# EAGLE design CapSens (EAGLE 7.2.0)
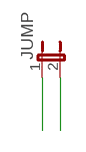
[diagram p0: schematic, sheet 1]

## Parts
JUMP  JP1E  [JP1]

## Nets
N$1: JUMP.1
N$2: JUMP.2

## Library data of the parts
JUMP = jumper:JP1E: JUMPER

## Board
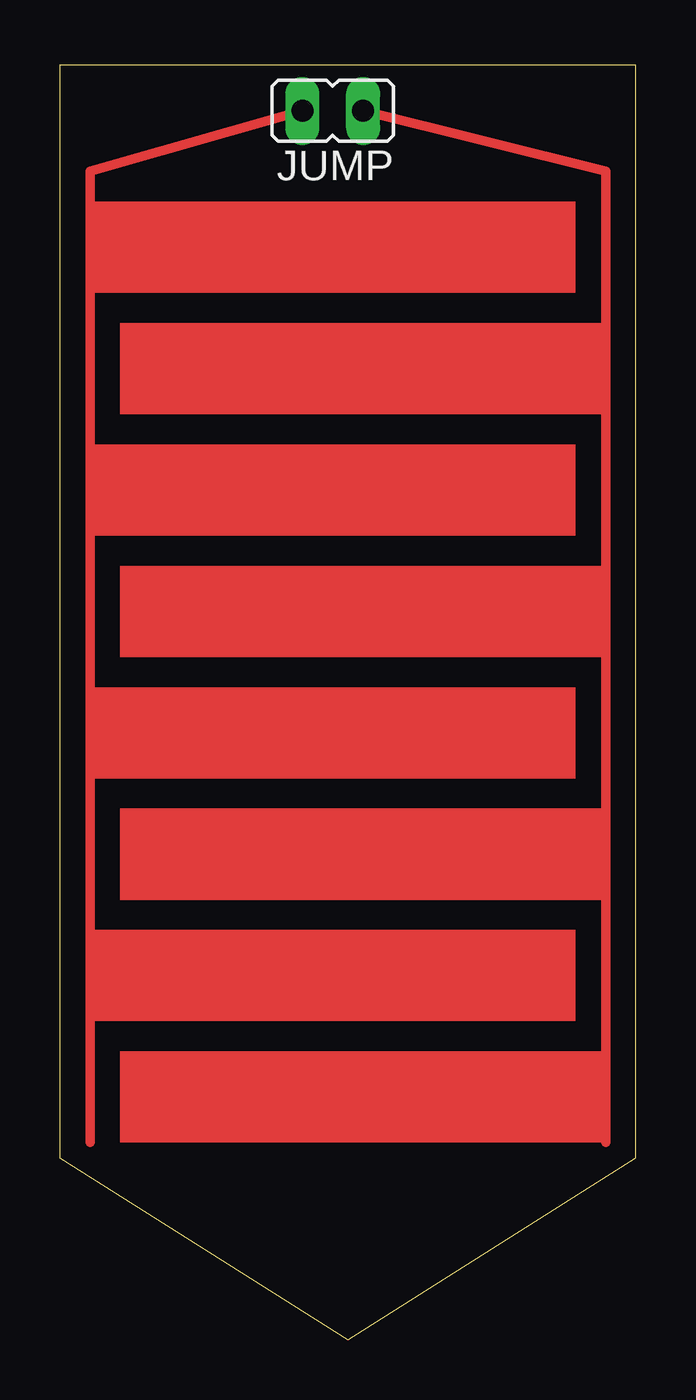
[diagram p1: board, top side]
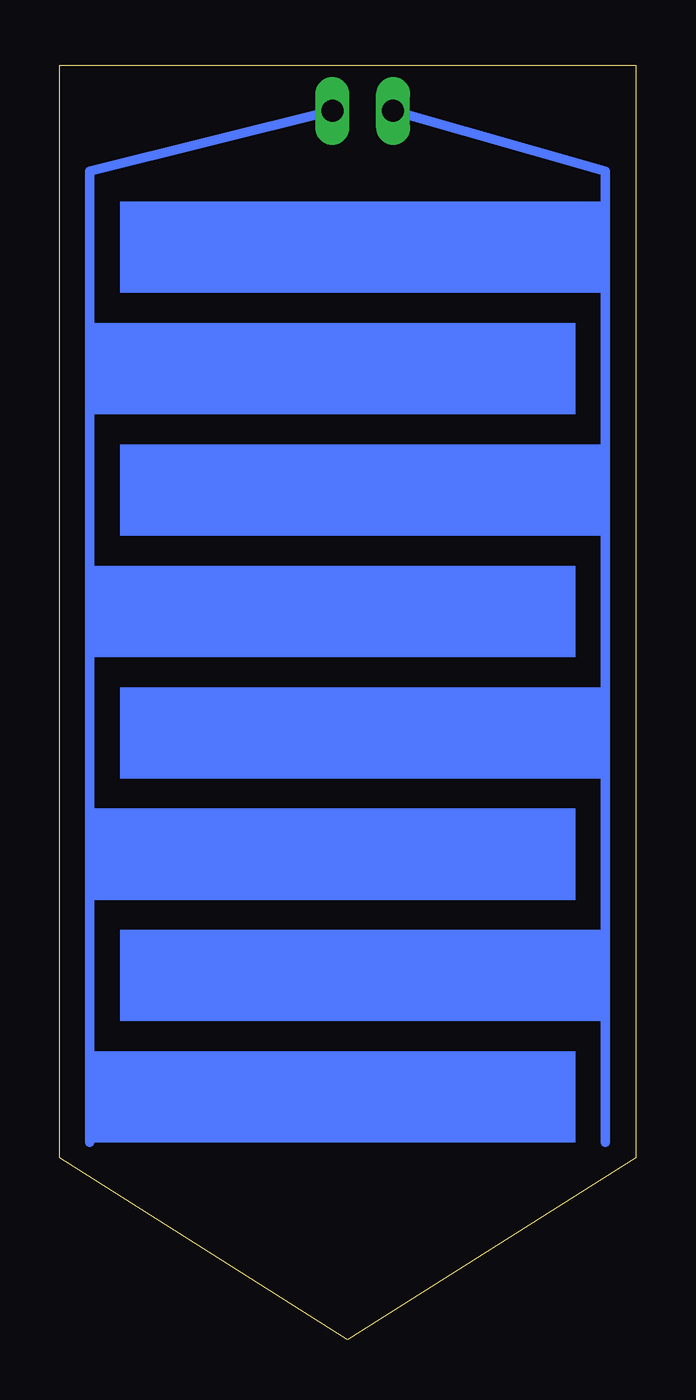
[diagram p2: board, bottom side, seen from below]

Size 24.12 x 53.33 mm. Coordinates in mm from the lower left corner, seen from the top.
Outline: 0,7.62 12.06,0 24.12,7.62 24.12,53.33 0,53.33 0,7.62
Copper layers (1*16): Top 0.035mm / dielectric 1.5mm / Bottom 0.035mm
Design rules "default": minimum track width 10mil, minimum drill 24mil, track to track 8mil, track to pad 8mil, pad to pad 8mil, via to via 8mil, smd to smd 8mil, copper to edge 40mil, drill to drill 8mil, minimum pad ring 10mil, minimum via ring 8mil, stop-mask expansion 4mil, vias tented up to drill 0mil, thermal gap 10mil

### Footprints (pad centres in the part's own frame; a part is rotated, then mirrored left to right if it is on the bottom)
JP1 = drill 0.914 long: 1 0,-1.27; 2 0,1.27

### Placement (x,y rotation side)
JUMP  11.43,51.43 90 top

### Tracks (layer width: path | path; a pad name or v marks a point on that pad's centre or on a via)
N$1
  Top 0.406: JUMP.1 22.86,48.89 22.86,8.26
  Bottom 0.406: JUMP.1 22.86,48.89 22.86,8.26
N$2
  Top 0.406: JUMP.2 1.27,48.89 1.27,8.26
  Bottom 0.406: JUMP.2 1.27,48.89 1.27,8.26
(copper drawn outside any net)
  shapes: Bottom area x8, Top area x8